# Altium schematic sheet motor_controller.SchDoc
size A
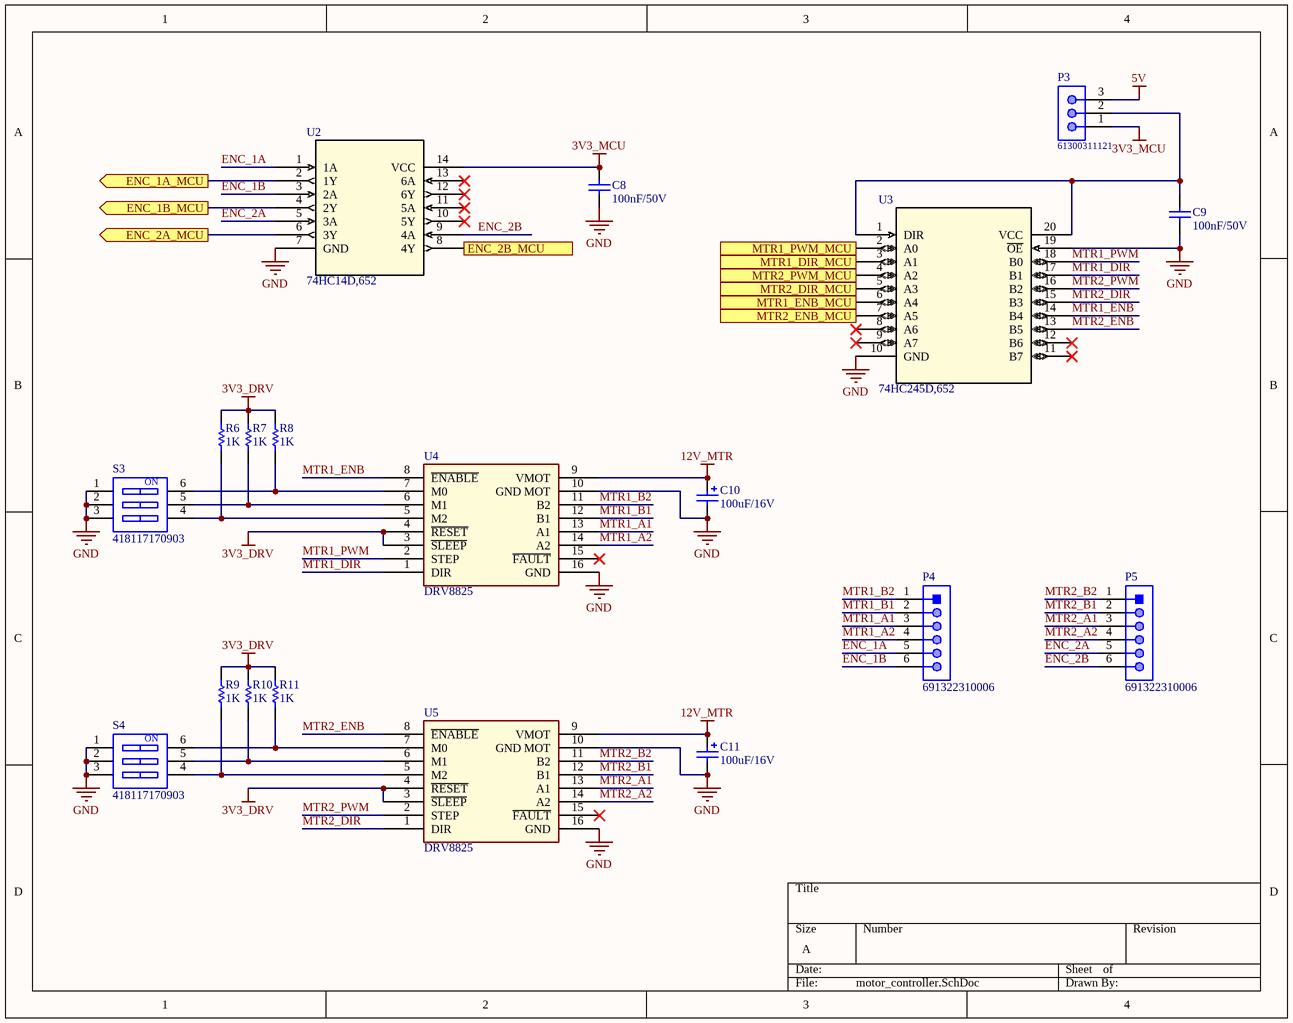
[diagram p0: motor_controller.SchDoc]

## Parts
C8  value 100nF/50V  [CAP-SM-0805]  (hidden comment: Cap-100nF-50V-0805)
C9  value 100nF/50V  [CAP-SM-0805]  (hidden comment: Cap-100nF-50V-0805)
C10  value 100uF/16V  [CAP-SM-AL-SIZE-D-D6L6]  (hidden comment: Cap-Al-100uF-16V-D6L5)
C11  value 100uF/16V  [CAP-SM-AL-SIZE-D-D6L6]  (hidden comment: Cap-Al-100uF-16V-D6L5)
P3  61300311121  [61300311121]
P4  691322310006  [691322310006]
P5  691322310006  [691322310006]
R6  value 1K  [RES-SM-0805]  (hidden comment: Res-1K-0805)
R7  value 1K  [RES-SM-0805]  (hidden comment: Res-1K-0805)
R8  value 1K  [RES-SM-0805]  (hidden comment: Res-1K-0805)
R9  value 1K  [RES-SM-0805]  (hidden comment: Res-1K-0805)
R10  value 1K  [RES-SM-0805]  (hidden comment: Res-1K-0805)
R11  value 1K  [RES-SM-0805]  (hidden comment: Res-1K-0805)
S3  418117170903  [418117170903]
S4  418117170903  [418117170903]
U2  74HC14D,652  [74HC14D,652]
U3  74HC245D,652  [74HC245D,652]
U4  DRV8825  [DRV8825]
U5  DRV8825  [DRV8825]

## Ports
ENC_1A_MCU (out), ENC_1B_MCU (out), ENC_2A_MCU (out), ENC_2B_MCU (out), MTR1_DIR_MCU (in), MTR1_ENB_MCU (in), MTR1_PWM_MCU (in), MTR2_DIR_MCU (in), MTR2_ENB_MCU (in), MTR2_PWM_MCU (in)

## Nets
3V3_DRV: R6.2 R7.2 R8.2 R9.2 R10.2 R11.2 U4.3(~{SLEEP}) U4.4(~{RESET}) U5.3(~{SLEEP}) U5.4(~{RESET})
3V3_MCU: C8.2 P3.1 U2.14(VCC)
5V: P3.3
12V_MTR: C10.1 C11.1 U4.9(VMOT) U5.9(VMOT)
GND: C8.1 C9.1 C10.2 C11.2 S3.1 S3.2 S3.3 S4.1 S4.2 S4.3 U2.7(GND) U3.10(GND) U3.19(~{OE}) U4.10(GND_MOT) U4.16(GND) U5.10(GND_MOT) U5.16(GND)
ENC_1A: P4.5 U2.1(1A)
ENC_1A_MCU: U2.2(1Y) ; port ENC_1A_MCU
ENC_1B: P4.6 U2.3(2A)
ENC_1B_MCU: U2.4(2Y) ; port ENC_1B_MCU
ENC_2A: P5.5 U2.5(3A)
ENC_2A_MCU: U2.6(3Y) ; port ENC_2A_MCU
ENC_2B: P5.6 U2.9(4A)
ENC_2B_MCU: U2.8(4Y) ; port ENC_2B_MCU
MTR1_A1: P4.3 U4.13(A1)
MTR1_A2: P4.4 U4.14(A2)
MTR1_B1: P4.2 U4.12(B1)
MTR1_B2: P4.1 U4.11(B2)
MTR1_DIR: U3.17(B1) U4.1(DIR)
MTR1_DIR_MCU: U3.3(A1) ; port MTR1_DIR_MCU
MTR1_ENB: U3.14(B4) U4.8(~{ENABLE})
MTR1_ENB_MCU: U3.6(A4) ; port MTR1_ENB_MCU
MTR1_PWM: U3.18(B0) U4.2(STEP)
MTR1_PWM_MCU: U3.2(A0) ; port MTR1_PWM_MCU
MTR2_A1: P5.3 U5.13(A1)
MTR2_A2: P5.4 U5.14(A2)
MTR2_B1: P5.2 U5.12(B1)
MTR2_B2: P5.1 U5.11(B2)
MTR2_DIR: U3.15(B3) U5.1(DIR)
MTR2_DIR_MCU: U3.5(A3) ; port MTR2_DIR_MCU
MTR2_ENB: U3.13(B5) U5.8(~{ENABLE})
MTR2_ENB_MCU: U3.7(A5) ; port MTR2_ENB_MCU
MTR2_PWM: U3.16(B2) U5.2(STEP)
MTR2_PWM_MCU: U3.4(A2) ; port MTR2_PWM_MCU
NetC9_2: C9.2 P3.2 U3.1(DIR) U3.20(VCC)
NetR6_1: R6.1 S3.4 U4.5(M2)
NetR7_1: R7.1 S3.5 U4.6(M1)
NetR8_1: R8.1 S3.6 U4.7(M0)
NetR9_1: R9.1 S4.4 U5.5(M2)
NetR10_1: R10.1 S4.5 U5.6(M1)
NetR11_1: R11.1 S4.6 U5.7(M0)

Not connected (* = marked no-connect by the designer): U2 10(5Y)* 11(5A)* 12(6Y)* 13(6A)*; U3 8(A6)* 9(A7)* 11(B7)* 12(B6)*; U4 15(~{FAULT})*; U5 15(~{FAULT})*

## Notes on the sheet
- (in symbol 418117170903) ON

## Library data of the parts
C8 C9 = Cap-100nF-50V-0805: CAP CER 0.1UF 50V Y5V 0805; Manufacturer: Samsung Electro-Mechanics; Manufacturer Part Number: CL21F104ZBCNNNC; Local Supplier: thegioiic; Local Supplier Link: https://thegioiic.com/products/tu-100nf-0-1uf-50v-0805; Supplier 1: Digikey; Supplier 1 Part Number: 1276-1007-1-ND; Supplier 1 Link: https://www.digikey.com/product-detail/en/samsung-electro-mechanics/CL21F104ZBCNNNC/1276-1007-1-ND/3889093
C10 C11 = Cap-Al-100uF-16V-D6L5: CAP ALUM 100UF 20% 16V SMD; Manufacturer: Nichicon; Manufacturer Part Number: UWX1C101MCL1GB; Local Supplier: thegioiic; Local Supplier Link: https://thegioiic.com/products/tu-nhom-smd-100uf-16v-d6-3l5-4; Supplier 1: Digikey; Supplier 1 Part Number: 493-2105-1-ND; Supplier 1 Link: https://www.digikey.com/product-detail/en/nichicon/UWX1C101MCL1GB/493-2105-1-ND/590080
P3 = 61300311121: WR-PHD Pin Header, THT, pitch 2.54mm, Single Row, Vertical, 3p; Manufacturer: Wurth Elektronik; Pin Number: 3; Rated Current: 3A; Working Voltage: 250VAC; Withstanding Voltage: 500VAC; Contact Resistance: 20mOhm; ComponentLink1Description: Manufacturer; ComponentLink1URL: http://www.we-online.de; ComponentLink2Description: Datasheet; ComponentLink2URL: https://www.we-online.com/catalog/datasheet/61300311121.pdf; Manufacturer Part Number: 61300311121; Published Date: May 2020; Pitch: 2.54mm; Operating Temperature: -40 to +105degC; Mounting Technology: THT; Packaging: Bag; Gender: Pin Header; Row Number: Single; Orientation: Vertical
P4 P5 = 691322310006: WR-TBL Serie 322 Horizontal PCB Header, Pluggable, pitch 3.81mm, 6p; Compliance: RoHS; Modularity: No; Pin Number: 6; Rated Current [UL]: 10A; Working Voltage [UL]: 300VAC; ComponentLink1Description: Manufacturer; ComponentLink1URL: http://www.we-online.de; ComponentLink2URL: https://katalog.we-online.de/em/datasheet/691322310006.pdf; ComponentLink2Description: Datasheet; Mounting Technology: THT; Part Number: 691322310006; Packaging: Box; Operating Temperature: -40 to +105degC; PCB/Cable/Panel: PCB; Pitch: 3.81mm; Published Date: October 2019; Type: Horizontal; Publisher: Wurth Elektronik; Application: Pluggable
R6-R11 = Res-1K-0805: RES 1K OHM 1% 1/4W 0805; Manufacturer: Stackpole Electronics Inc; Manufacturer Part Number: RNCP0805FTD1K00; Local Supplier: thegioiic; Local Supplier Link: https://thegioiic.com/products/dien-tro-1k-ohm-0805-5; Supplier 1: Digikey; Supplier 1 Link: https://www.digikey.com/product-detail/en/stackpole-electronics-inc/RNCP0805FTD1K00/RNCP0805FTD1K00CT-ND/2240568; Supplier 1 Part Number: RNCP0805FTD1K00CT-ND
S3 S4 = 418117170903: WS-DITV Compact THT Dip Switch, Flat Actuator, pitch 2.54mm, 3p; Operation Force: 800g; Pole Number: 3; Actuator Type: Flat Type; Circuit: SPST-NO; Rated Current Switching: 25mA; Rated Current Non-Switching: 100mA; Rated Voltage Non-Switching: 50VDC; Rated Voltage Switching: 24VDC; ComponentLink1Description: Manufacturer; ComponentLink1URL: http://www.we-online.de; ComponentLink2Description: Datasheet; ComponentLink2URL: https://katalog.we-online.com/em/datasheet/418117170903.pdf; Pitch: 2.54mm; Contact Material: Copper Alloy; Mounting Technology: THT; Operating Temperature: -40 to +85degC; Contact Plating: Gold; Packaging: Tube; Part Number: 418117170903; Publisher: Wurth Elektronik; Published Date: September 2019
U2 = 74HC14D,652: Vendor: Nexperia; SourceLibrary: Nexperia_2018-05-2018; Manufacturer_Part_Number: 74HC14D,652; Copyright: Copyright (C) 2016 Accelerated Designs. All rights reserved; RefDes: RefDes; Type: DEV
U3 = 74HC245D,652: Vendor: Nexperia; SourceLibrary: Nexperia_2018-05-2018; Manufacturer_Part_Number: 74HC245D,652; Copyright: Copyright (C) 2016 Accelerated Designs. All rights reserved; RefDes: RefDes; Type: DEV